# Altium project ECG-Circuit.PrjPcb
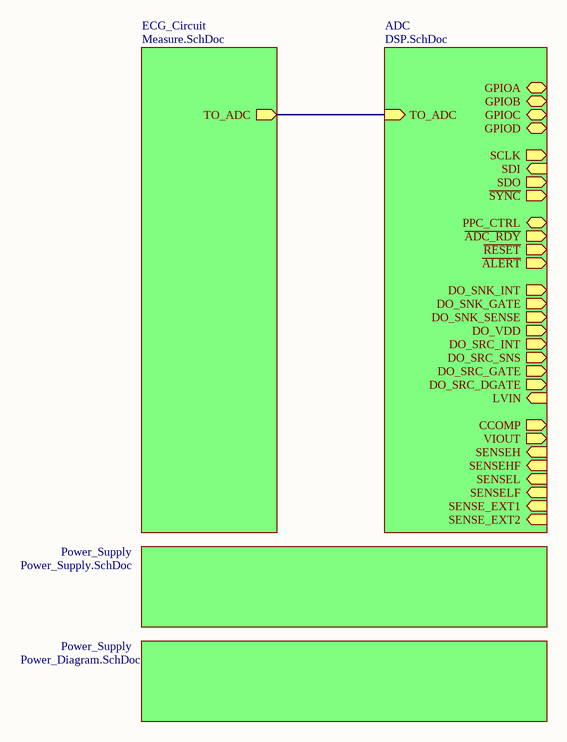
[diagram p0: System_Diagram.SchDoc]
5 sheets, 110 parts. Net scope: hierarchical (ports join the sheet entries above them; power ports are global).
Board file: PCB1.PcbDoc
Sheets:
  System_Diagram.SchDoc
    ECG_Circuit = Measure.SchDoc
    ADC = DSP.SchDoc
    Power_Supply = Power_Supply.SchDoc
    Power_Supply = Power_Diagram.SchDoc

## Sheet System_Diagram.SchDoc
size A4; SheetNumber: 1; SheetTotal: 5

### Sub-sheets
ADC = DSP.SchDoc: TO_ADC (in), GPIOA (bidir), GPIOB (bidir), GPIOC (bidir), GPIOD (bidir), SCLK (out), SDI (in), SDO (out), ~{SYNC} (out), PPC_CTRL (bidir), ~{ADC_RDY} (out), ~{RESET} (out), ~{ALERT} (out), DO_SNK_INT (out), DO_SNK_GATE (out), DO_SNK_SENSE (out), DO_VDD (out), DO_SRC_INT (out), DO_SRC_SNS (out), DO_SRC_GATE (out), DO_SRC_DGATE (out), LVIN (in), CCOMP (out), VIOUT (out), SENSEH (in), SENSEHF (in), SENSEL (in), SENSELF (in), SENSE_EXT1 (in), SENSE_EXT2 (in)
ECG_Circuit = Measure.SchDoc: TO_ADC (out)
Power_Supply = Power_Supply.SchDoc: no entries
Power_Supply = Power_Diagram.SchDoc: no entries

### Nets
TO_ADC: sheet ECG_Circuit/TO_ADC, sheet ADC/TO_ADC

## Sheet Measure.SchDoc
size A3; SheetNumber: 4; SheetTotal: 5
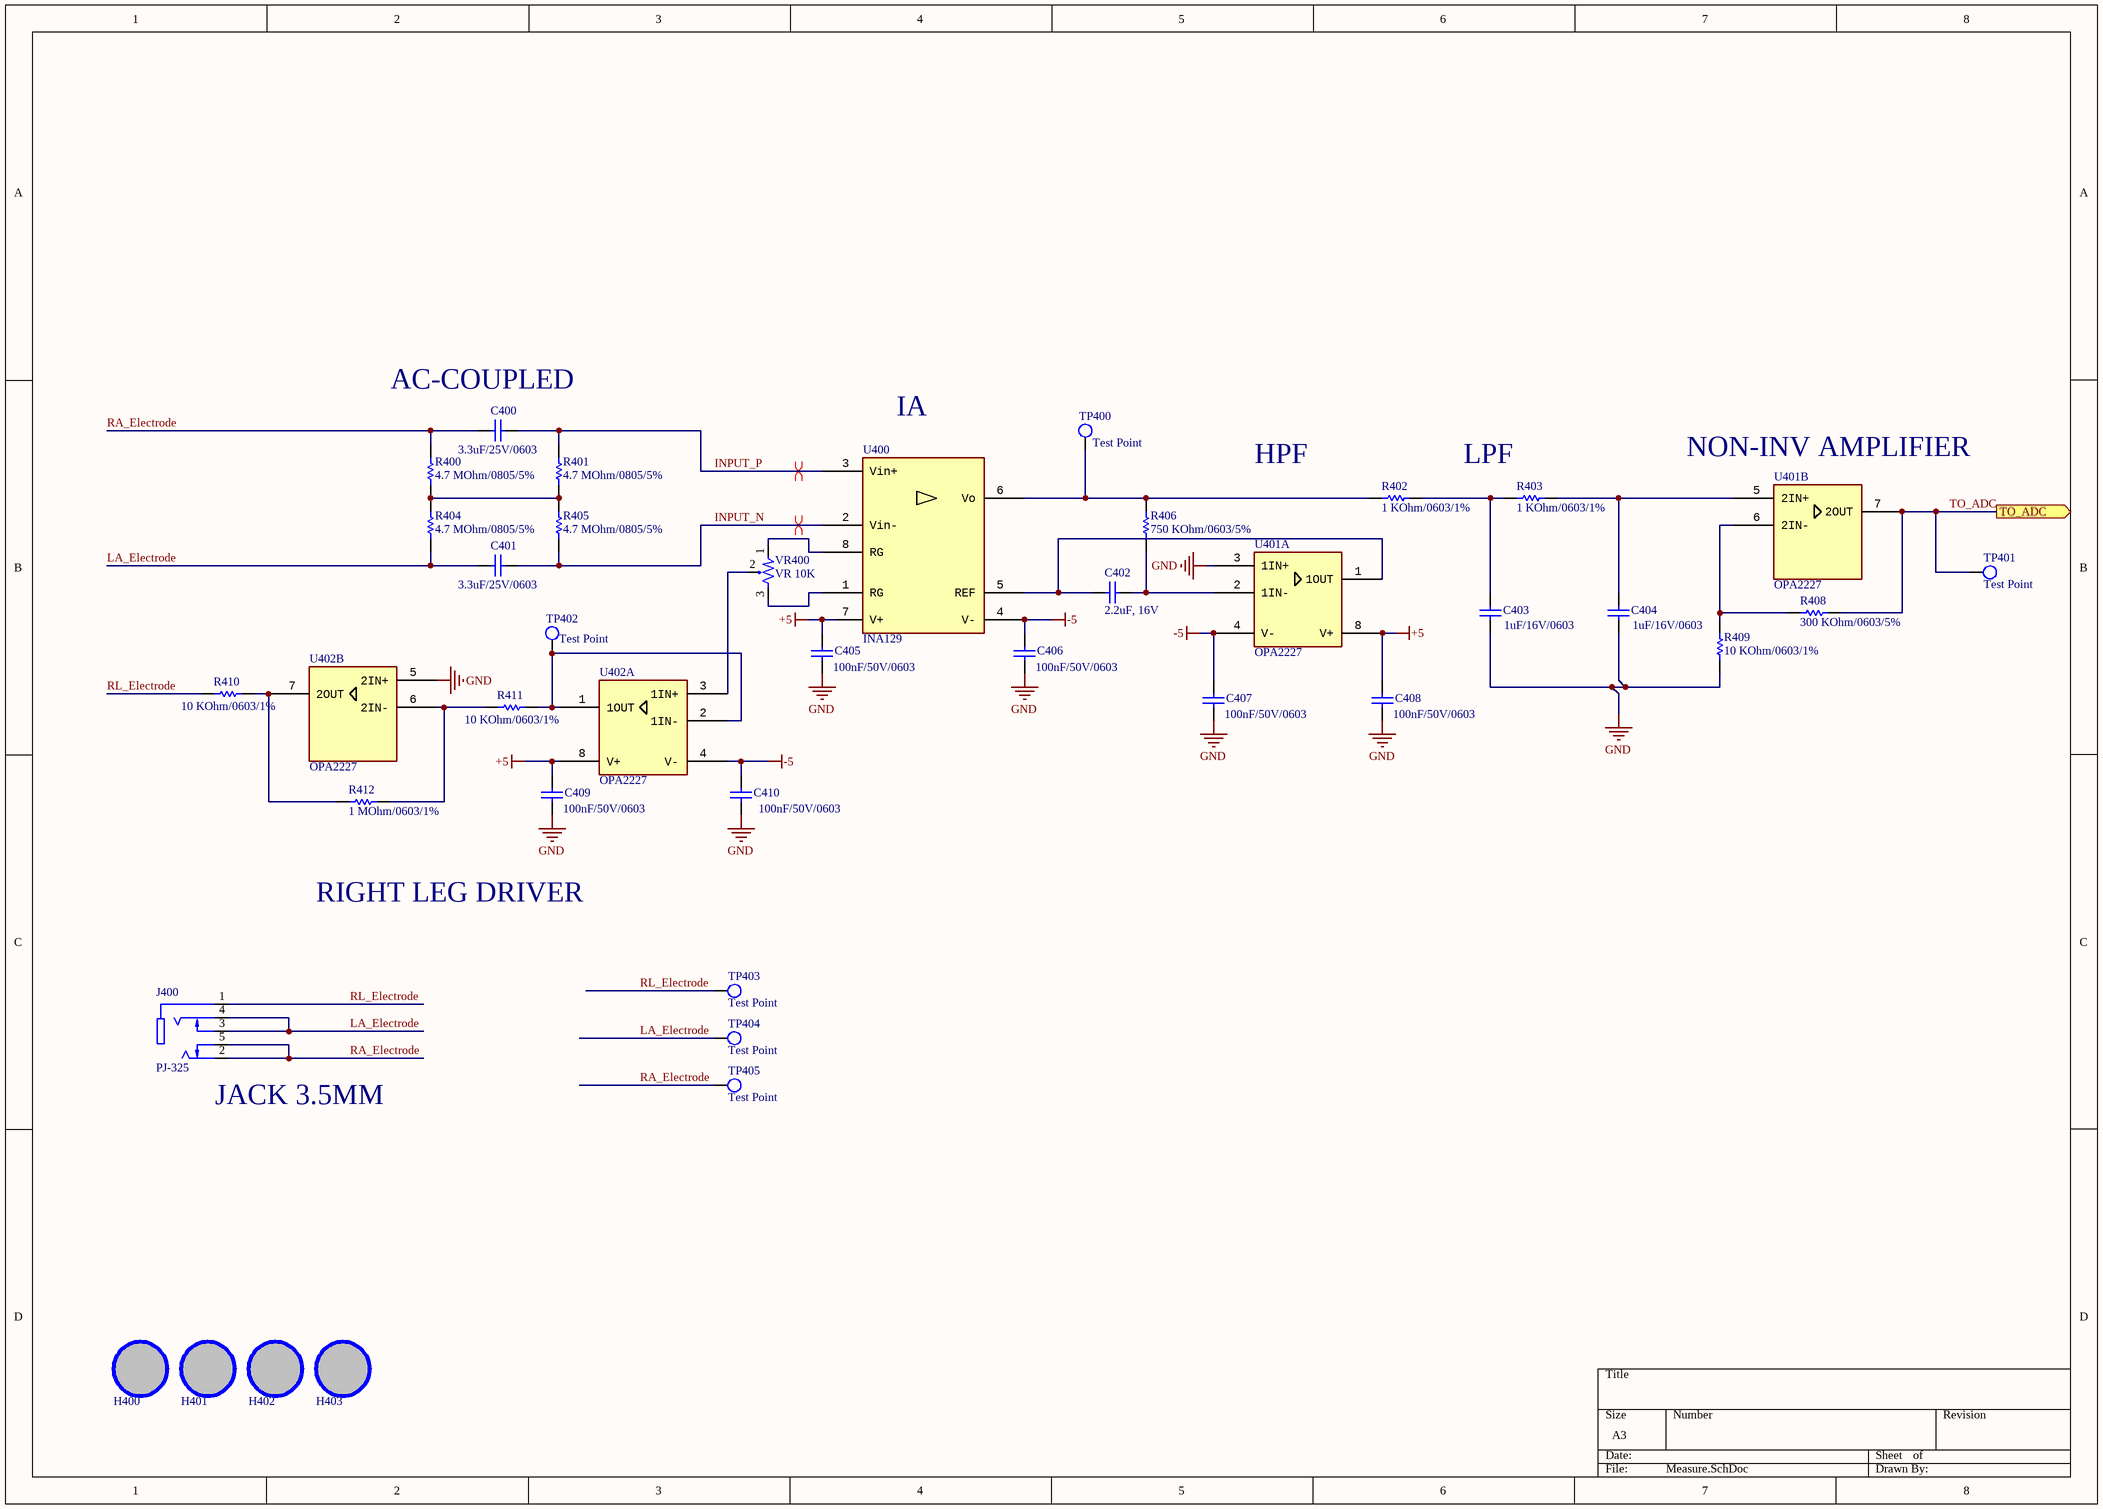
[diagram p1: Measure.SchDoc]

### Parts
C400  value 3.3uF/25V/0603  [WCAP-CSGP_0805_H=1.25mm]  (hidden comment: 3.3uF, 25V)
C401  value 3.3uF/25V/0603  [WCAP-CSGP_0805_H=1.25mm]  (hidden comment: 3.3uF, 25V)
C402  2.2uF, 16V  [WCAP-CSGP_0603_H=0.8mm_Reflow]
C403  value 1uF/16V/0603  [WCAP-CSGP_0603_H=0.8mm_Reflow]  (hidden comment: 1uF, 16V)
C404  value 1uF/16V/0603  [WCAP-CSGP_0603_H=0.8mm_Reflow]  (hidden comment: 1uF, 16V)
C405  value 100nF/50V/0603  [WCAP-CSGP_0603_H=0.8mm_Reflow]  (hidden comment: 100nF, 25V)
C406  value 100nF/50V/0603  [WCAP-CSGP_0603_H=0.8mm_Reflow]  (hidden comment: 100nF, 25V)
C407  value 100nF/50V/0603  [WCAP-CSGP_0603_H=0.8mm_Reflow]  (hidden comment: 100nF, 25V)
C408  value 100nF/50V/0603  [WCAP-CSGP_0603_H=0.8mm_Reflow]  (hidden comment: 100nF, 25V)
C409  value 100nF/50V/0603  [WCAP-CSGP_0603_H=0.8mm_Reflow]  (hidden comment: 100nF, 25V)
C410  value 100nF/50V/0603  [WCAP-CSGP_0603_H=0.8mm_Reflow]  (hidden comment: 100nF, 25V)
H400  Hole  [LO KHOAN 3MM]  (value not drawn)
H401  Hole  [LO KHOAN 3MM]  (value not drawn)
H402  Hole  [LO KHOAN 3MM]  (value not drawn)
H403  Hole  [LO KHOAN 3MM]  (value not drawn)
J400  value PJ-325  [3.5 mm, Strereo]  (hidden comment: PJ-324)
R400  value 4.7 MOhm/0805/5%  [R0805]  (hidden comment: Resistor 4.7 MOhm 0805 5%)
R401  value 4.7 MOhm/0805/5%  [R0805]  (hidden comment: Resistor 4.7 MOhm 0805 5%)
R402  value 1 KOhm/0603/1%  [R0603]  (hidden comment: Resistor 1 KOhm 0603 1%)
R403  value 1 KOhm/0603/1%  [R0603]  (hidden comment: Resistor 1 KOhm 0603 1%)
R404  value 4.7 MOhm/0805/5%  [R0805]  (hidden comment: Resistor 4.7 MOhm 0805 5%)
R405  value 4.7 MOhm/0805/5%  [R0805]  (hidden comment: Resistor 4.7 MOhm 0805 5%)
R406  value 750 KOhm/0603/5%  [R0603]  (hidden comment: Resistor 750 KOhm 0603 5%)
R408  value 300 KOhm/0603/5%  [R0603]  (hidden comment: Resistor 300 KOhm 0603 5%)
R409  value 10 KOhm/0603/1%  [R0603]  (hidden comment: Resistor 10 KOhm 0603 1%)
R410  value 10 KOhm/0603/1%  [R0603]  (hidden comment: Resistor 10 KOhm 0603 1%)
R411  value 10 KOhm/0603/1%  [R0603]  (hidden comment: Resistor 10 KOhm 0603 1%)
R412  value 1 MOhm/0603/1%  [R0603]  (hidden comment: Resistor 1 MOhm 0603 1%)
TP400  Test Point  [TP]
TP401  Test Point  [TP]
TP402  Test Point  [TP]
TP403  Test Point  [TP]
TP404  Test Point  [TP]
TP405  Test Point  [TP]
U400  INA129  [SOIC-8]
U401  OPA2227  [SOIC-8]  (parts A,B of 2)
U402  OPA2227  [SOIC-8]  (parts A,B of 2)
VR400  value VR 10K  [VARISTOR 2]  (hidden comment: 10K)

### Ports
TO_ADC (out)

### Nets
+5: C405.2 C408.1 C409.2 U400.7(V+) U401.8(V+) U402.8(V+)
-5: C406.1 C407.2 C410.1 U400.4(V-) U401.4(V-) U402.4(V-)
GND: C403.1 C404.1 C405.1 C406.2 C407.1 C408.2 C409.1 C410.2 R409.1 U401.3(1IN+) U402.5(2IN+)
INPUT_N: C401.2 R405.1 U400.2(Vin-)
INPUT_P: C400.2 R401.2 U400.3(Vin+)
LA_Electrode: C401.1 J400.3 J400.4 R404.1 TP404.TP1
RA_Electrode: C400.1 J400.2 J400.5 R400.2 TP405.TP1
RL_Electrode: J400.1 R410.1 TP403.TP1
TO_ADC: R408.2 TP401.TP1 U401.7(2OUT) ; port TO_ADC
NetC402_1: C402.1 R406.1 U401.2(1IN-)
NetC402_2: C402.2 U400.5(REF) U401.1(1OUT)
NetC403_2: C403.2 R402.2 R403.1
NetC404_2: C404.2 R403.2 U401.5(2IN+)
NetR400_1: R400.1 R401.1 R404.2 R405.2
NetR402_1: R402.1 R406.2 TP400.TP1 U400.6(Vo)
NetR408_1: R408.1 R409.2 U401.6(2IN-)
NetR410_2: R410.2 R412.1 U402.7(2OUT)
NetR411_1: R411.1 R412.2 U402.6(2IN-)
NetR411_2: R411.2 TP402.TP1 U402.1(1OUT) U402.2(1IN-)
NetU400_1: U400.1(RG) VR400.3
NetU400_8: U400.8(RG) VR400.1
NetU402_3: U402.3(1IN+) VR400.2

Not connected (* = marked no-connect by the designer): H400 1; H401 1; H402 1; H403 1

### Layout directives
differential pair: INPUT_N, INPUT_P

### Notes on the sheet
- (near C400) AC-COUPLED
- (near U400) IA
- HPF
- (near R403) LPF
- (near U401) NON-INV AMPLIFIER
- RIGHT LEG DRIVER
- (near J400) JACK 3.5MM

### Library data of the parts
C400 C401 = 885012107017: WCAP-CSGP Multilayer Ceramic Chip Capacitor, General Purpose, size 0805, X5R, 3.3uF, 25V; Manufacturer: Wurth Elektronik; Rated Voltage: 25VDC; Isolation Resistance: >=0.03GOhm; Capacitance Tolerance: +/-20%; Technical Reference: X5R0805335M025DFCT10000; ComponentLink1Description: Manufacturer; ComponentLink1URL: http://www.we-online.de; ComponentLink2Description: Datasheet; ComponentLink2URL: https://www.we-online.com/catalog/datasheet/885012107017.pdf; Operating Temperature: -55 to +85degC; Packaging: Tape and Reel; Manufacturer Part Number: 885012107017; Published Date: May 2020; Ceramic Type: X5R; Dissipation Factor: =<10%; Height: 1.25mm; Mounting Technology: SMT; Size: 0805
C402 = 885012106018: WCAP-CSGP Multilayer Ceramic Chip Capacitor, General Purpose, size 0603, X5R, 2.2uF, 16V; Manufacturer: Wurth Elektronik; Rated Voltage: 16VDC; Isolation Resistance: >=0.05GOhm; Capacitance Tolerance: +/-20%; Technical Reference: X5R0603225M016DFCT10000; ComponentLink1Description: Manufacturer; ComponentLink1URL: http://www.we-online.de; ComponentLink2Description: Datasheet; ComponentLink2URL: https://www.we-online.com/catalog/datasheet/885012106018.pdf; Operating Temperature: -55 to +85degC; Packaging: Tape and Reel; Manufacturer Part Number: 885012106018; Published Date: May 2020; Ceramic Type: X5R; Dissipation Factor: =<10%; Height: 0.8mm; Mounting Technology: SMT; Size: 0603; Capacitance: 2.2uF
C403 C404 = 885012106017: WCAP-CSGP Multilayer Ceramic Chip Capacitor, General Purpose, size 0603, X5R, 1uF, 16V; Manufacturer: Wurth Elektronik; Rated Voltage: 16VDC; Isolation Resistance: >=0.1GOhm; Capacitance Tolerance: +/-20%; Technical Reference: X5R0603105M016DFCT10000; ComponentLink1Description: Manufacturer; ComponentLink1URL: http://www.we-online.de; ComponentLink2Description: Datasheet; ComponentLink2URL: https://www.we-online.com/catalog/datasheet/885012106017.pdf; Operating Temperature: -55 to +85degC; Packaging: Tape and Reel; Manufacturer Part Number: 885012106017; Published Date: May 2020; Ceramic Type: X5R; Dissipation Factor: =<10%; Height: 0.8mm; Mounting Technology: SMT; Size: 0603
C405-C410 = 885012206071: WCAP-CSGP Multilayer Ceramic Chip Capacitor, General Purpose, size 0603, X7R, 100nF, 25V; Manufacturer: Wurth Elektronik; Rated Voltage: 25VDC; Isolation Resistance: >=5GOhm; Capacitance Tolerance: +/-10%; Technical Reference: X7R0603104K025DFCT10000; ComponentLink1Description: Manufacturer; ComponentLink1URL: http://www.we-online.de; ComponentLink2Description: Datasheet; ComponentLink2URL: https://www.we-online.com/catalog/datasheet/885012206071.pdf; Operating Temperature: -55 to +125degC; Packaging: Tape and Reel; Manufacturer Part Number: 885012206071; Published Date: May 2020; Ceramic Type: X7R; Dissipation Factor: =<3.5%; Height: 0.8mm; Mounting Technology: SMT; Size: 0603
H400-H403 = Hole: Hole 3mm
J400 = PJ-324: Jack 3.5 3-Pole 5-Pin; ComponentLink1Description: Buy; ComponentLink1URL: https://www.thegioiic.com/pj-324-cong-audio-3-5mm-3-cuc-5-chan-han-pcb
R400 R401 R404 R405 = Resistor 4.7 MOhm 0805 5%: Code 475, 1/8W; ComponentLink1Description: Buy; ComponentLink1URL: https://www.thegioiic.com/dien-tro-4-7-mohm-0805-5-
R402 R403 = Resistor 1 KOhm 0603 1%: Code 102, 1/10W; ComponentLink1Description: Buy; ComponentLink1URL: https://www.thegioiic.com/dien-tro-1-kohm-0603-1
R406 = Resistor 750 KOhm 0603 5%: Code 754, 1/10W
R408 = Resistor 300 KOhm 0603 5%: Code 304, 1/10W
R409-R411 = Resistor 10 KOhm 0603 1%: Code 103, 1/10W; ComponentLink1Description: Buy; ComponentLink1URL: https://www.thegioiic.com/dien-tro-10-kohm-0603-1-
R412 = Resistor 1 MOhm 0603 1%: Code 105, 1/10W; ComponentLink1Description: Buy; ComponentLink1URL: https://www.thegioiic.com/dien-tro-1-mohm-0603-1-
U400 = INA129: Precision, Low Power Instrumentation Amplifiers; ComponentLink1Description: Buy; ComponentLink1URL: *; ComponentLink2Description: Datasheet; ComponentLink2URL: https://www.ti.com/lit/ds/symlink/ina129-ep.pdf?ts=1697381225295&ref_url=https%253A%252F%252Fwww.google.com%252F; Value: INA129
U401 U402 = OPA2227: High-Precision, Low-Noise Operational Amplifiers; ComponentLink1Description: Datasheet; ComponentLink1URL: https://www.ti.com/lit/ds/symlink/opa2227.pdf?ts=1697381749451&ref_url=https%253A%252F%252Fwww.ti.com%252Fproduct%252FOPA2227; Value: OPA2227
VR400 = Var Resistor

## Sheet DSP.SchDoc
size A3; SheetNumber: 5; SheetTotal: 5
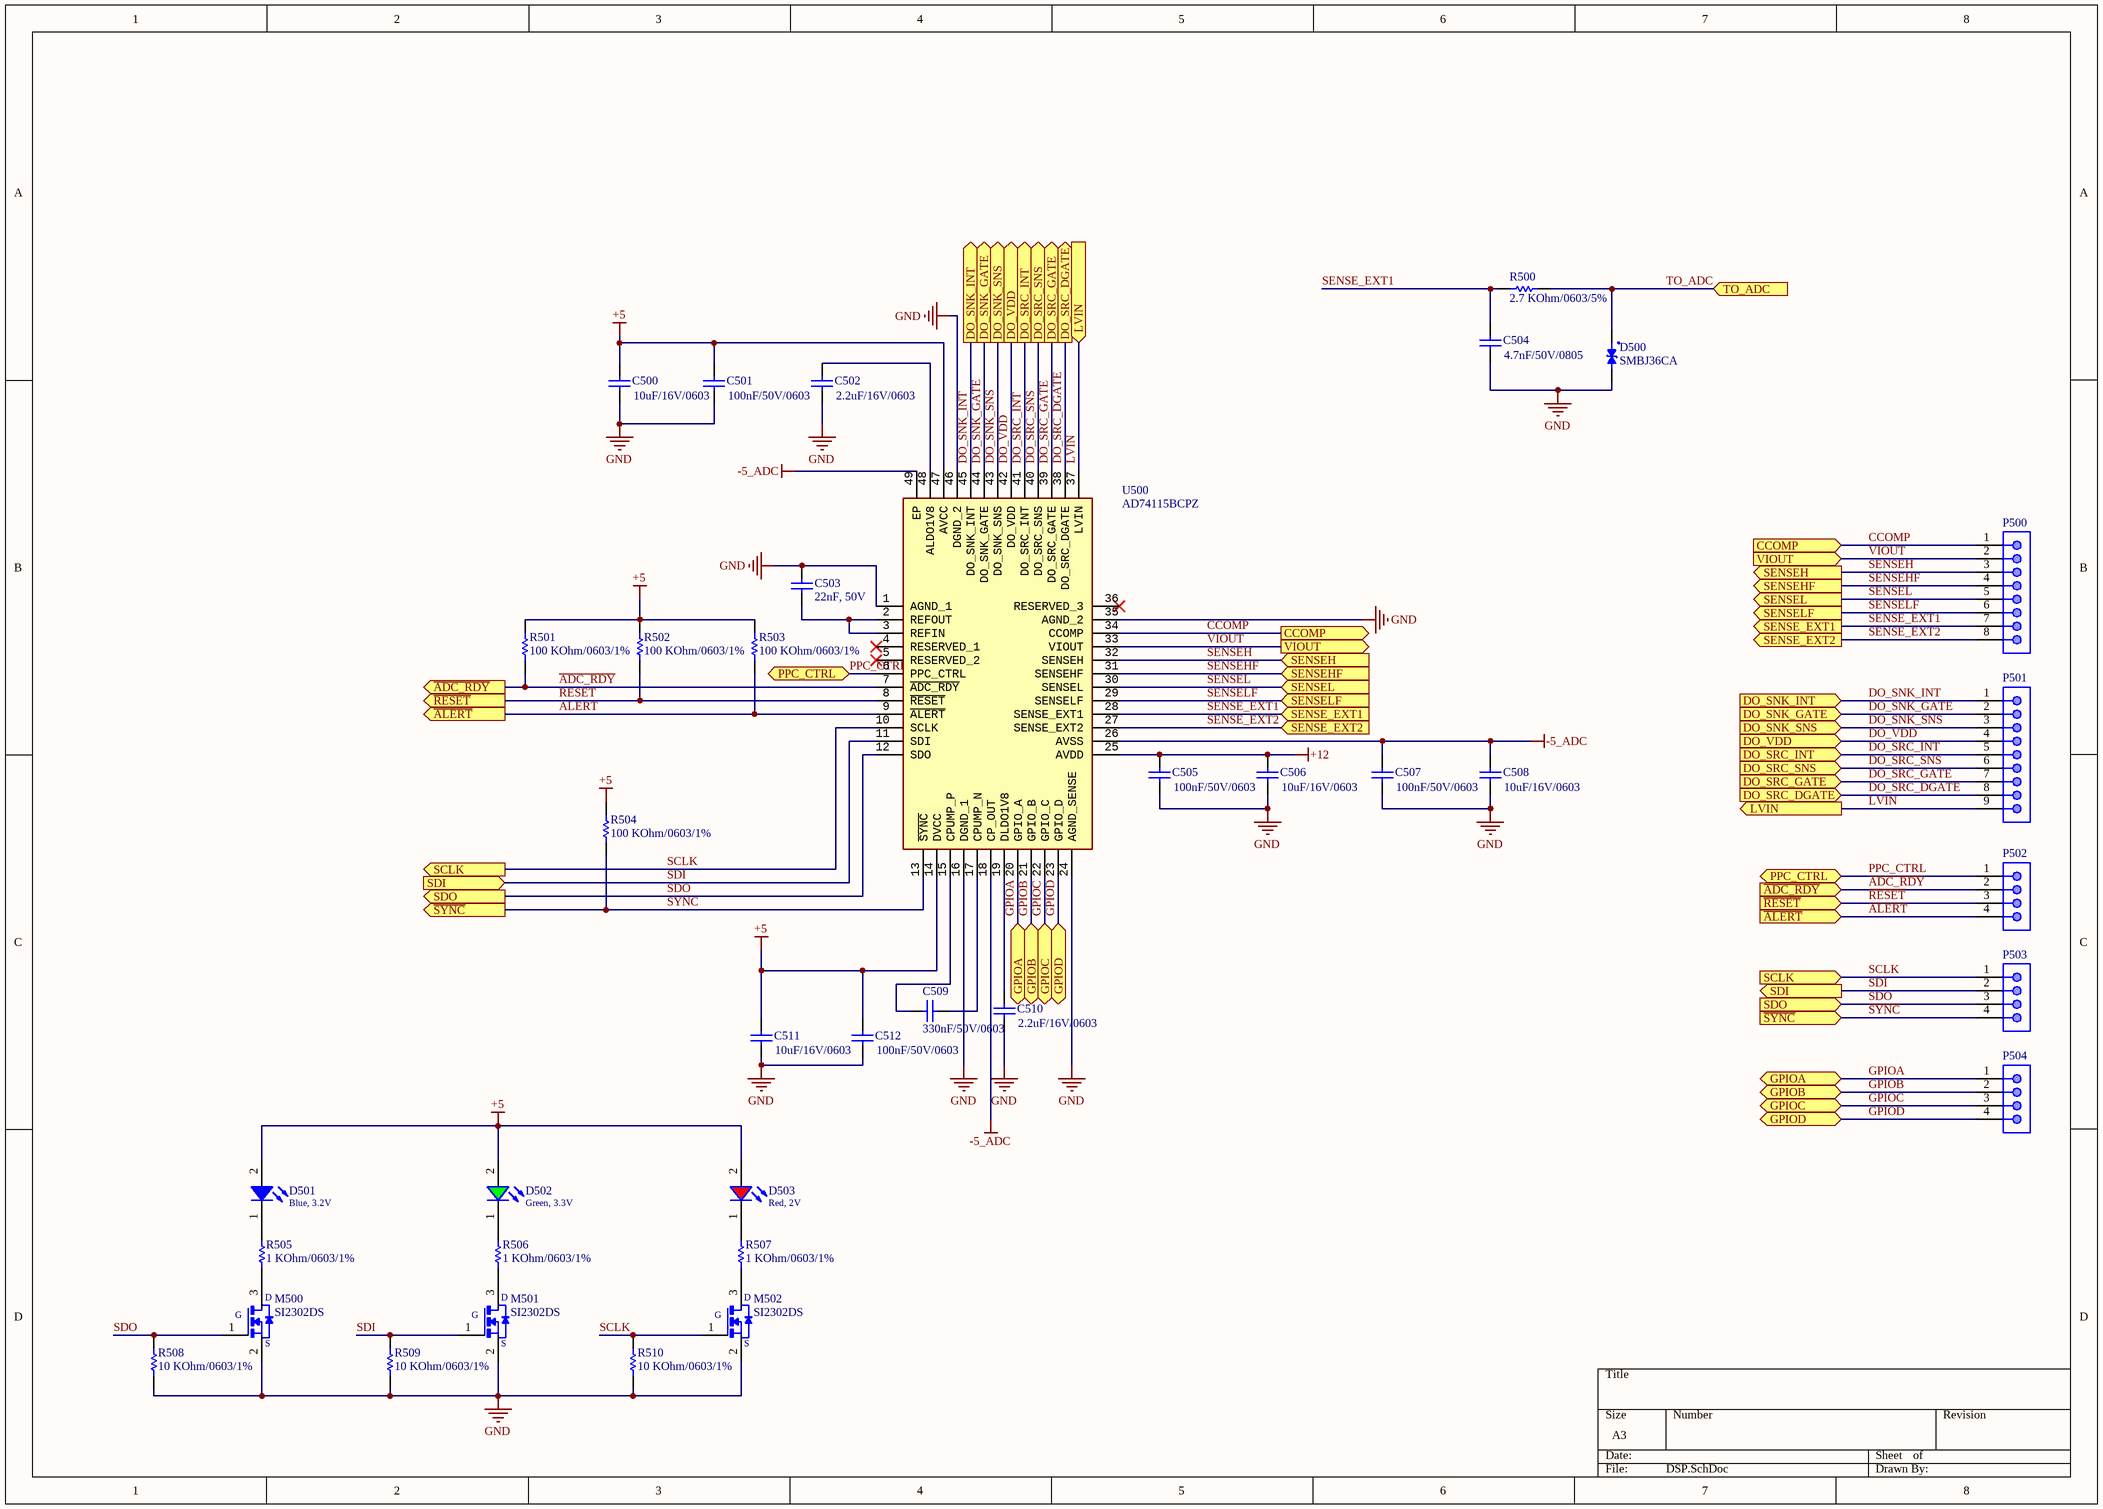
[diagram p2: DSP.SchDoc]

### Parts
C500  value 10uF/16V/0603  [WCAP-CSGP_0603_H=0.8mm_Reflow]  (hidden comment: 10uF, 6.3V)
C501  Capacitance: 100nF/50V/0603  [WCAP-CSGP_0603_H=0.8mm_Reflow]  (hidden comment: 100nF, 50V)
C502  value 2.2uF/16V/0603  [WCAP-CSGP_0603_H=0.8mm_Reflow]  (hidden comment: 2.2uF, 16V)
C503  22nF, 50V  [WCAP-CSGP_0603_H=0.8mm_Reflow]
C504  Capacitance: 4.7nF/50V/0805  [WCAP-CSGP_0805_H=1.25mm]  (hidden comment: 4.7nF, 100V)
C505  Capacitance: 100nF/50V/0603  [WCAP-CSGP_0603_H=0.8mm_Reflow]  (hidden comment: 100nF, 50V)
C506  value 10uF/16V/0603  [WCAP-CSGP_0603_H=0.8mm_Reflow]  (hidden comment: 10uF, 6.3V)
C507  Capacitance: 100nF/50V/0603  [WCAP-CSGP_0603_H=0.8mm_Reflow]  (hidden comment: 100nF, 50V)
C508  value 10uF/16V/0603  [WCAP-CSGP_0603_H=0.8mm_Reflow]  (hidden comment: 10uF, 6.3V)
C509  value 330nF/50V/0603  [WCAP-CSGP_0603_H=0.8mm_Reflow]  (hidden comment: 330nF, 50V)
C510  value 2.2uF/16V/0603  [WCAP-CSGP_0603_H=0.8mm_Reflow]  (hidden comment: 2.2uF, 16V)
C511  value 10uF/16V/0603  [WCAP-CSGP_0603_H=0.8mm_Reflow]  (hidden comment: 10uF, 6.3V)
C512  Capacitance: 100nF/50V/0603  [WCAP-CSGP_0603_H=0.8mm_Reflow]  (hidden comment: 100nF, 50V)
D500  SMBJ36CA  [DIOM4336X265N]
D501  Blue, 3.2V  [WL-SMCW_0603 dome]
D502  Green, 3.3V  [WL-SMCW_0603 dome]
D503  Red, 2V  [WL-SMCW_0603 dome]
M500  value SI2302DS  [SOT23]  (hidden comment: SI2302)
M501  value SI2302DS  [SOT23]  (hidden comment: SI2302)
M502  value SI2302DS  [SOT23]  (hidden comment: SI2302)
P500  61300811121  [61300811121]  (value not drawn)
P501  61300911121  [61300911121]  (value not drawn)
P502  61300411121  [61300411121]  (value not drawn)
P503  61300411121  [61300411121]  (value not drawn)
P504  61300411121  [61300411121]  (value not drawn)
R500  value 2.7 KOhm/0603/5%  [R0603]  (hidden comment: Resistor 2.7 KOhm 0603 5%)
R501  value 100 KOhm/0603/1%  [R0603]  (hidden comment: Resistor 100 KOhm 0603 1%)
R502  value 100 KOhm/0603/1%  [R0603]  (hidden comment: Resistor 100 KOhm 0603 1%)
R503  value 100 KOhm/0603/1%  [R0603]  (hidden comment: Resistor 100 KOhm 0603 1%)
R504  value 100 KOhm/0603/1%  [R0603]  (hidden comment: Resistor 100 KOhm 0603 1%)
R505  value 1 KOhm/0603/1%  [R0603]  (hidden comment: Resistor 1 KOhm 0603 1%)
R506  value 1 KOhm/0603/1%  [R0603]  (hidden comment: Resistor 1 KOhm 0603 1%)
R507  value 1 KOhm/0603/1%  [R0603]  (hidden comment: Resistor 1 KOhm 0603 1%)
R508  value 10 KOhm/0603/1%  [R0603]  (hidden comment: Resistor 10 KOhm 0603 1%)
R509  value 10 KOhm/0603/1%  [R0603]  (hidden comment: Resistor 10 KOhm 0603 1%)
R510  value 10 KOhm/0603/1%  [R0603]  (hidden comment: Resistor 10 KOhm 0603 1%)
U500  AD74115BCPZ  [QFN50P700X700X80-49N-D]

### Ports
CCOMP (in), CCOMP (out), DO_SNK_GATE (in), DO_SNK_GATE (out), DO_SNK_INT (in), DO_SNK_INT (out), DO_SNK_SNS (in), DO_SNK_SNS (out), DO_SRC_DGATE (in), DO_SRC_DGATE (out), DO_SRC_GATE (in), DO_SRC_GATE (out), DO_SRC_INT (in), DO_SRC_INT (out), DO_SRC_SNS (in), DO_SRC_SNS (out), DO_VDD (in), DO_VDD (out), GPIOA (bidir), GPIOB (bidir), GPIOC (bidir), GPIOD (bidir), LVIN (in), LVIN (out), PPC_CTRL (bidir), SCLK (in), SCLK (out), SDI (in), SDI (out), SDO (in), SDO (out), SENSE_EXT1 (in), SENSE_EXT1 (out), SENSE_EXT2 (in), SENSE_EXT2 (out), SENSEH (in), SENSEH (out), SENSEHF (in), SENSEHF (out), SENSEL (in), SENSEL (out), SENSELF (in), SENSELF (out), TO_ADC (in), VIOUT (in), VIOUT (out), ~{ADC_RDY} (in), ~{ADC_RDY} (out), ~{ALERT} (in), ~{ALERT} (out), ~{RESET} (in), ~{RESET} (out), ~{SYNC} (in), ~{SYNC} (out)

### Nets
+5: C500.2 C501.2 C511.2 C512.2 D501.2(A) D502.2(A) D503.2(A) R501.2 R502.2 R503.2 R504.1 U500.14(DVCC) U500.47(AVCC)
+12: C505.2 C506.2 U500.25(AVDD)
-5_ADC: C507.2 C508.2 U500.18(CP_OUT) U500.26(AVSS) U500.49(EP)
GND: C500.1 C501.1 C502.1 C503.2 C504.1 C505.1 C506.1 C507.1 C508.1 C510.1 C511.1 C512.1 D500.2 M500.2(S) M501.2(S) M502.2(S) R508.1 R509.1 R510.1 U500.1(AGND_1) U500.16(DGND_1) U500.24(AGND_SENSE) U500.35(AGND_2) U500.46(DGND_2)
~{ADC_RDY}: P502.2 R501.1 U500.7(~{ADC_RDY}) ; port ~{ADC_RDY}
~{ALERT}: P502.4 R503.1 U500.9(~{ALERT}) ; port ~{ALERT}
CCOMP: P500.1 U500.34(CCOMP) ; port CCOMP
DO_SNK_GATE: P501.2 U500.44(DO_SNK_GATE) ; port DO_SNK_GATE
DO_SNK_INT: P501.1 U500.45(DO_SNK_INT) ; port DO_SNK_INT
DO_SNK_SNS: P501.3 U500.43(DO_SNK_SNS) ; port DO_SNK_SNS
DO_SRC_DGATE: P501.8 U500.38(DO_SRC_DGATE) ; port DO_SRC_DGATE
DO_SRC_GATE: P501.7 U500.39(DO_SRC_GATE) ; port DO_SRC_GATE
DO_SRC_INT: P501.5 U500.41(DO_SRC_INT) ; port DO_SRC_INT
DO_SRC_SNS: P501.6 U500.40(DO_SRC_SNS) ; port DO_SRC_SNS
DO_VDD: P501.4 U500.42(DO_VDD) ; port DO_VDD
GPIOA: P504.1 U500.20(GPIO_A) ; port GPIOA
GPIOB: P504.2 U500.21(GPIO_B) ; port GPIOB
GPIOC: P504.3 U500.22(GPIO_C) ; port GPIOC
GPIOD: P504.4 U500.23(GPIO_D) ; port GPIOD
LVIN: P501.9 U500.37(LVIN) ; port LVIN
PPC_CTRL: P502.1 U500.6(PPC_CTRL) ; port PPC_CTRL
~{RESET}: P502.3 R502.1 U500.8(~{RESET}) ; port ~{RESET}
~{SYNC}: P503.4 R504.2 U500.13(~{SYNC}) ; port ~{SYNC}
SCLK: M502.1(G) P503.1 R510.2 U500.10(SCLK) ; port SCLK
SDI: M501.1(G) P503.2 R509.2 U500.11(SDI) ; port SDI
SDO: M500.1(G) P503.3 R508.2 U500.12(SDO) ; port SDO
SENSE_EXT1: C504.2 P500.7 R500.1 U500.28(SENSE_EXT1) ; port SENSE_EXT1
SENSE_EXT2: P500.8 U500.27(SENSE_EXT2) ; port SENSE_EXT2
SENSEH: P500.3 U500.32(SENSEH) ; port SENSEH
SENSEHF: P500.4 U500.31(SENSEHF) ; port SENSEHF
SENSEL: P500.5 U500.30(SENSEL) ; port SENSEL
SENSELF: P500.6 U500.29(SENSELF) ; port SENSELF
TO_ADC: D500.1 R500.2 ; port TO_ADC
VIOUT: P500.2 U500.33(VIOUT) ; port VIOUT
NetC502_2: C502.2 U500.48(ALDO1V8)
NetC503_1: C503.1 U500.2(REFOUT) U500.3(REFIN)
NetC509_1: C509.1 U500.17(CPUMP_N)
NetC509_2: C509.2 U500.15(CPUMP_P)
NetC510_2: C510.2 U500.19(DLDO1V8)
NetD501_1: D501.1(K) R505.2
NetD502_1: D502.1(K) R506.2
NetD503_1: D503.1(K) R507.2
NetM500_3: M500.3(D) R505.1
NetM501_3: M501.3(D) R506.1
NetM502_3: M502.3(D) R507.1

Not connected (* = marked no-connect by the designer): U500 4(RESERVED_1)* 5(RESERVED_2)* 36(RESERVED_3)*

### Library data of the parts
C500 C506 C508 C511 = 885012106006: WCAP-CSGP Multilayer Ceramic Chip Capacitor, General Purpose, size 0603, X5R, 10uF, 6.3V; Manufacturer: Wurth Elektronik; Rated Voltage: 6.3VDC; Isolation Resistance: >=0.01GOhm; Capacitance Tolerance: +/-20%; Technical Reference: X5R0603106M6R3DFCT10000; ComponentLink1Description: Manufacturer; ComponentLink1URL: http://www.we-online.de; ComponentLink2Description: Datasheet; ComponentLink2URL: https://www.we-online.com/catalog/datasheet/885012106006.pdf; Operating Temperature: -55 to +85degC; Packaging: Tape and Reel; Manufacturer Part Number: 885012106006; Published Date: May 2020; Ceramic Type: X5R; Dissipation Factor: =<10%; Height: 0.8mm; Mounting Technology: SMT; Size: 0603
C501 C505 C507 C512 = 885012206095: WCAP-CSGP Multilayer Ceramic Chip Capacitor, General Purpose, size 0603, X7R, 100nF, 50V; Manufacturer: Wurth Elektronik; Rated Voltage: 50VDC; Isolation Resistance: >=5GOhm; Capacitance Tolerance: +/-10%; Technical Reference: X7R0603104K050DFCT10000; ComponentLink1Description: Manufacturer; ComponentLink1URL: http://www.we-online.de; ComponentLink2Description: Datasheet; ComponentLink2URL: https://www.we-online.com/catalog/datasheet/885012206095.pdf; Operating Temperature: -55 to +125degC; Packaging: Tape and Reel; Manufacturer Part Number: 885012206095; Published Date: May 2020; Ceramic Type: X7R; Dissipation Factor: =<3%; Height: 0.8mm; Mounting Technology: SMT; Size: 0603
C502 C510 = 885012106018: as C402 on sheet Measure; ComponentLink1Description: Manufacturer; ComponentLink1URL: http://www.we-online.de; ComponentLink2Description: Datasheet; ComponentLink2URL: https://www.we-online.com/catalog/datasheet/885012106018.pdf; Operating Temperature: -55 to +85degC; Packaging: Tape and Reel; Manufacturer Part Number: 885012106018; Published Date: May 2020; Ceramic Type: X5R; Dissipation Factor: =<10%; Height: 0.8mm; Mounting Technology: SMT; Size: 0603
C503 = 885012206091: WCAP-CSGP Multilayer Ceramic Chip Capacitor, General Purpose, size 0603, X7R, 22nF, 50V; Manufacturer: Wurth Elektronik; Rated Voltage: 50VDC; Isolation Resistance: >=10GOhm; Capacitance Tolerance: +/-10%; Technical Reference: X7R0603223K050DFCT10000; ComponentLink1Description: Manufacturer; ComponentLink1URL: http://www.we-online.de; ComponentLink2Description: Datasheet; ComponentLink2URL: https://www.we-online.com/catalog/datasheet/885012206091.pdf; Operating Temperature: -55 to +125degC; Packaging: Tape and Reel; Manufacturer Part Number: 885012206091; Published Date: May 2020; Ceramic Type: X7R; Dissipation Factor: =<2.5%; Height: 0.8mm; Mounting Technology: SMT; Size: 0603; Capacitance: 22nF
C504 = 885012007092: WCAP-CSGP Multilayer Ceramic Chip Capacitor, General Purpose, size 0805, NP0, 4.7nF, 100V; Manufacturer: Wurth Elektronik; Rated Voltage: 100VDC; Isolation Resistance: >=10GOhm; Capacitance Tolerance: +/-5%; Dissipation Factor: Q>=1000; Technical Reference: NP00805472J100DFCT10000; ComponentLink1Description: Manufacturer; ComponentLink1URL: http://www.we-online.de; ComponentLink2Description: Datasheet; ComponentLink2URL: https://www.we-online.com/catalog/datasheet/885012007092.pdf; Operating Temperature: -55 to +125degC; Packaging: Tape and Reel; Manufacturer Part Number: 885012007092; Published Date: May 2020; Ceramic Type: NP0; Height: 1.25mm; Mounting Technology: SMT; Size: 0805
C509 = 885012206121: WCAP-CSGP Multilayer Ceramic Chip Capacitor, General Purpose, size 0603, X7R, 330nF, 50V; Manufacturer: Wurth Elektronik; Rated Voltage: 50VDC; Isolation Resistance: >=1.5GOhm; Capacitance Tolerance: +/-10%; Technical Reference: X7R0603334K050DFCT10000; ComponentLink1Description: Manufacturer; ComponentLink1URL: http://www.we-online.de; ComponentLink2Description: Datasheet; ComponentLink2URL: https://www.we-online.com/catalog/datasheet/885012206121.pdf; Operating Temperature: -55 to +125degC; Packaging: Tape and Reel; Manufacturer Part Number: 885012206121; Published Date: May 2020; Ceramic Type: X7R; Dissipation Factor: =<10%; Height: 0.8mm; Mounting Technology: SMT; Size: 0603
D500 = SMBJ36CA: 600W, 42.1V, 5%, Bidirectional, TVS; MF: Taiwan Semiconductor; SnapEDA_Link: https://www.snapeda.com/parts/SMBJ36CA/Taiwan+Semiconductor/view-part/?ref=snap; Package: SMB Taiwan Semiconductor; MP: SMBJ36CA; Check_prices: https://www.snapeda.com/parts/SMBJ36CA/Taiwan+Semiconductor/view-part/?ref=eda; Purchase-URL: https://pricing.snapeda.com/search/part/SMBJ36CA/?ref=eda; Price: None; Availability: In Stock; ComponentLink1Description: Buy; ComponentLink1URL: https://www.thegioiic.com/smbj36ca; Value: SMBJ36CA
D501 = 150060BS84000: WL-SMCW SMT Mono-color Chip LED Waterclear, size 0603 dome, Blue, 3.2V, 40deg; Chip Technology: InGaN; Dominant Wavelength typ.: 470nm; Luminous Intensity typ.: 560mcd; Peak Wavelength typ.: 465nm; Viewing Angle: 40deg; ComponentLink1Description: Manufacturer; ComponentLink1URL: http://www.we-online.de; ComponentLink2URL: https://www.we-online.com/catalog/datasheet/150060BS84000.pdf; ComponentLink2Description: Datasheet; Forward Voltage typ.: 3.2V; Emitting Color: Blue; Mounting Technology: SMT; Operating Temperature: -40 to +85degC; Published Date: December 2019; Part Number: 150060BS84000; Packaging: Tape and Reel; Size: 0603 dome; Publisher: Wurth Elektronik
D502 = 150060GS84000: WL-SMCW SMT Mono-color Chip LED Waterclear, size 0603 dome, Green, 3.3V, 40deg; Chip Technology: InGaN; Dominant Wavelength typ.: 525nm; Luminous Intensity typ.: 3000mcd; Peak Wavelength typ.: 520nm; Viewing Angle: 40deg; ComponentLink1Description: Manufacturer; ComponentLink1URL: http://www.we-online.de; ComponentLink2URL: https://www.we-online.com/catalog/datasheet/150060GS84000.pdf; ComponentLink2Description: Datasheet; Forward Voltage typ.: 3.3V; Emitting Color: Green; Mounting Technology: SMT; Operating Temperature: -40 to +85degC; Published Date: December 2019; Part Number: 150060GS84000; Packaging: Tape and Reel; Size: 0603 dome; Publisher: Wurth Elektronik
D503 = 150060RS86000: WL-SMCW SMT Mono-color Chip LED Waterclear, size 0603 dome, Red, 2V, 60deg; Chip Technology: AlInGaP; Dominant Wavelength typ.: 624nm; Luminous Intensity typ.: 800mcd; Peak Wavelength typ.: 632nm; Viewing Angle: 60deg; ComponentLink1Description: Manufacturer; ComponentLink1URL: http://www.we-online.de; ComponentLink2URL: https://www.we-online.com/catalog/datasheet/150060RS86000.pdf; ComponentLink2Description: Datasheet; Forward Voltage typ.: 2V; Emitting Color: Red; Mounting Technology: SMT; Operating Temperature: -40 to +85degC; Published Date: December 2019; Part Number: 150060RS86000; Packaging: Tape and Reel; Size: 0603 dome; Publisher: Wurth Elektronik
M500-M502 = SI2302: N-Channel 20 V 2.6A (Ta) 710mW (Ta) Surface Mount SOT-23-3 (TO-236); MF: Vishay Siliconix; Price: None; Availability: In Stock; Package: SOT-23-3 Vishay Siliconix; MP: SI2302; SnapEDA_Link: https://www.snapeda.com/parts/SI2302/Vishay+Siliconix/view-part/?ref=snap; Purchase-URL: https://pricing.snapeda.com/search/part/SI2302/?ref=eda; Check_prices: https://www.snapeda.com/parts/SI2302/Vishay+Siliconix/view-part/?ref=eda; ComponentLink1Description: Buy; ComponentLink1URL: https://www.thegioiic.com/si2302ds-mosfet-kenh-n-20v-2-5a-sot23
P500 = 61300811121: WR-PHD Pin Header, THT, pitch 2.54mm, Single Row, Vertical, 8p; Manufacturer: Wurth Elektronik; Pin Number: 8; Rated Current: 3A; Working Voltage: 250VAC; Withstanding Voltage: 500VAC; Contact Resistance: 20mOhm; ComponentLink1Description: Manufacturer; ComponentLink1URL: http://www.we-online.de; ComponentLink2Description: Datasheet; ComponentLink2URL: https://www.we-online.com/catalog/datasheet/61300811121.pdf; Manufacturer Part Number: 61300811121; Published Date: May 2020; Pitch: 2.54mm; Operating Temperature: -40 to +105degC; Mounting Technology: THT; Packaging: Bag; Gender: Pin Header; Row Number: Single; Orientation: Vertical
P501 = 61300911121: WR-PHD Pin Header, THT, pitch 2.54mm, Single Row, Vertical, 9p; Manufacturer: Wurth Elektronik; Pin Number: 9; Rated Current: 3A; Working Voltage: 250VAC; Withstanding Voltage: 500VAC; Contact Resistance: 20mOhm; ComponentLink1Description: Manufacturer; ComponentLink1URL: http://www.we-online.de; ComponentLink2Description: Datasheet; ComponentLink2URL: https://www.we-online.com/catalog/datasheet/61300911121.pdf; Manufacturer Part Number: 61300911121; Published Date: May 2020; Pitch: 2.54mm; Operating Temperature: -40 to +105degC; Mounting Technology: THT; Packaging: Bag; Gender: Pin Header; Row Number: Single; Orientation: Vertical
P502-P504 = 61300411121: WR-PHD Pin Header, THT, pitch 2.54mm, Single Row, Vertical, 4p; Manufacturer: Wurth Elektronik; Pin Number: 4; Rated Current: 3A; Working Voltage: 250VAC; Withstanding Voltage: 500VAC; Contact Resistance: 20mOhm; ComponentLink1Description: Manufacturer; ComponentLink1URL: http://www.we-online.de; ComponentLink2Description: Datasheet; ComponentLink2URL: https://www.we-online.com/catalog/datasheet/61300411121.pdf; Manufacturer Part Number: 61300411121; Published Date: May 2020; Pitch: 2.54mm; Operating Temperature: -40 to +105degC; Mounting Technology: THT; Packaging: Bag; Gender: Pin Header; Row Number: Single; Orientation: Vertical
R500 = Resistor 2.7 KOhm 0603 5%: Code 272, 1/10W; ComponentLink1Description: Buy; ComponentLink1URL: https://www.thegioiic.com/dien-tro-2-7-kohm-0603-5-
R501-R504 = Resistor 100 KOhm 0603 1%: Code 104, 1/10W; ComponentLink1Description: Buy; ComponentLink1URL: https://www.thegioiic.com/dien-tro-100-kohm-0603-1-
R505-R507 = Resistor 1 KOhm 0603 1%: Code 102, 1/10W; ComponentLink1Description: Buy; ComponentLink1URL: https://www.thegioiic.com/dien-tro-1-kohm-0603-1
R508-R510 = Resistor 10 KOhm 0603 1%: Code 103, 1/10W; ComponentLink1Description: Buy; ComponentLink1URL: https://www.thegioiic.com/dien-tro-10-kohm-0603-1-
U500 = AD74115BCPZ: Single-Channel, Software Configurable Input and Output; Manufacturer_Name: Analog Devices; Geometry.Height: 0.8mm; Manufacturer_Part_Number: AD74115BCPZ; Mouser Part Number: 584-AD74115BCPZ; Mouser Price/Stock: https://www.mouser.co.uk/ProductDetail/Analog-Devices/AD74115BCPZ?qs=Jm2GQyTW%2FbiQ8agDBTeo0A%3D%3D; Arrow Part Number: *; Arrow Price/Stock: *; Datasheet Link: https://www.analog.com/AD74115/datasheet; Value: AD74115BCPZ

## Sheet Power_Supply.SchDoc
size A4; SheetNumber: 3; SheetTotal: 5
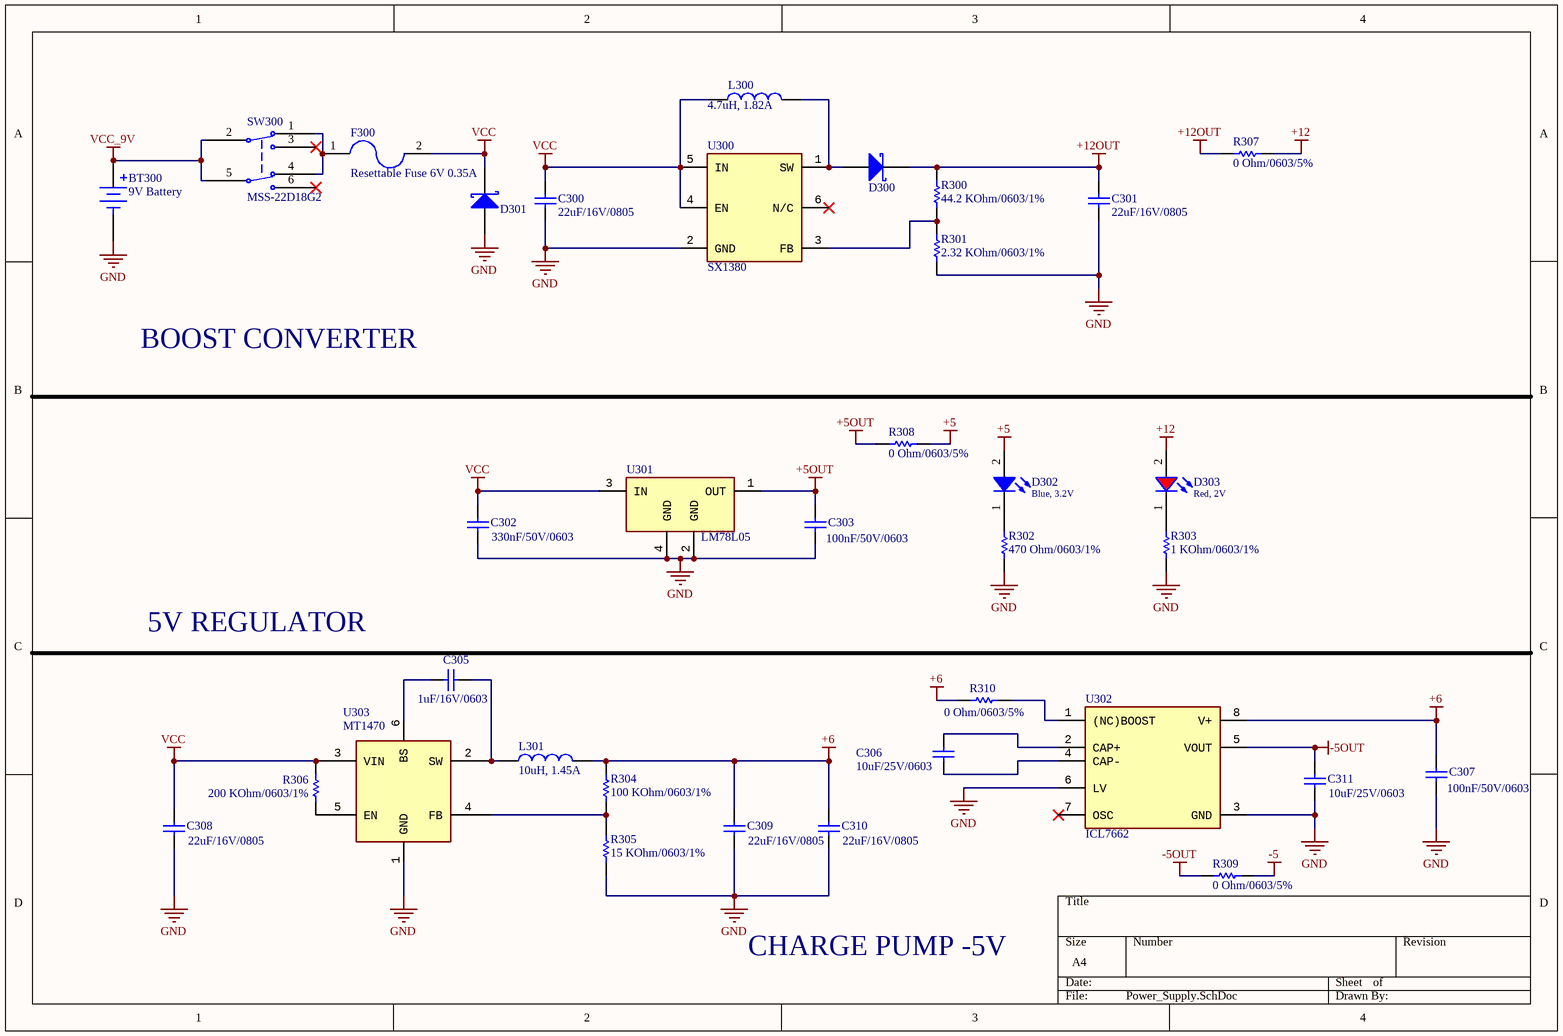
[diagram p3: Power_Supply.SchDoc]

### Parts
BT300  value 9V Battery  [BAT_BC9VPC]  (hidden comment: BC9VPC)
C300  value 22uF/16V/0805  [CAP-SM-0805]  (hidden comment: Cap Non-Pol SMD)
C301  value 22uF/16V/0805  [CAP-SM-0805]  (hidden comment: Cap Non-Pol SMD)
C302  value 330nF/50V/0603  [WCAP-CSGP_0603_H=0.8mm_Reflow]  (hidden comment: 330nF, 50V)
C303  value 100nF/50V/0603  [WCAP-CSGP_0603_H=0.8mm_Reflow]  (hidden comment: 100nF, 25V)
C305  value 1uF/16V/0603  [WCAP-CSGP_0603_H=0.8mm_Reflow]  (hidden comment: 1uF, 16V)
C306  value 10uF/25V/0603  [WCAP-CSGP_0603_H=0.8mm_Reflow]  (hidden comment: 10uF, 6.3V)
C307  value 100nF/50V/0603  [WCAP-CSGP_0603_H=0.8mm_Reflow]  (hidden comment: 100nF, 25V)
C308  value 22uF/16V/0805  [WCAP-CSGP_0805_H=1.25mm]  (hidden comment: 22uF, 10V)
C309  value 22uF/16V/0805  [WCAP-CSGP_0805_H=1.25mm]  (hidden comment: 22uF, 10V)
C310  value 22uF/16V/0805  [WCAP-CSGP_0805_H=1.25mm]  (hidden comment: 22uF, 10V)
C311  value 10uF/25V/0603  [WCAP-CSGP_0603_H=0.8mm_Reflow]  (hidden comment: 10uF, 6.3V)
D300  D Schottky  [SS34]  (value not drawn)
D301  D Schottky  [SS34]  (value not drawn)
D302  Blue, 3.2V  [WL-SMCW_0603_H=0.7mm]
D303  Red, 2V  [WL-SMCW_0603_H=0.7mm]
F300  value Resettable Fuse 6V 0.35A  [FUSE1206]  (hidden comment: RESETTABLE FUSE 1206)
L300  4.7uH, 1.82A  [WE-PD2A_4532]
L301  10uH, 1.45A  [WE-PD2A_4532]
R300  value 44.2 KOhm/0603/1%  [R0603]  (hidden comment: Resistor 44.2 KOhm 0603 1%)
R301  value 2.32 KOhm/0603/1%  [R0603]  (hidden comment: Resistor 2.32 KOhm 0603 1%)
R302  value 470 Ohm/0603/1%  [R0603]  (hidden comment: Resistor 470 Ohm 0603 1%)
R303  value 1 KOhm/0603/1%  [R0603]  (hidden comment: Resistor 1 KOhm 0603 1%)
R304  value 100 KOhm/0603/1%  [R0603]  (hidden comment: Resistor 100 KOhm 0603 1%)
R305  value 15 KOhm/0603/1%  [R0603]  (hidden comment: Resistor 15 KOhm 0603 1%)
R306  value 200 KOhm/0603/1%  [R0603]  (hidden comment: Resistor 200 KOhm 0603 5%)
R307  value 0 Ohm/0603/5%  [R0603]  (hidden comment: Resistor 0 Ohm 0603 5%)
R308  value 0 Ohm/0603/5%  [R0603]  (hidden comment: Resistor 0 Ohm 0603 5%)
R309  value 0 Ohm/0603/5%  [R0603]  (hidden comment: Resistor 0 Ohm 0603 5%)
R310  value 0 Ohm/0603/5%  [R0603]  (hidden comment: Resistor 0 Ohm 0603 5%)
SW300  value MSS-22D18G2  [MSS-22D18G2]  (hidden comment: Slide Switch)
U300  value SX1380  [SOT-23-6]  (hidden comment: SX1308)
U301  value LM78L05  [SOT-89]  (hidden comment: 78L05)
U302  value ICL7662  [SOIC-8]  (hidden comment: ICL7662EBA+)
U303  MT1470  [SOT-23-6]

### Nets
+5: D302.2(A) R308.2
+5OUT: C303.1 R308.1 U301.1(OUT)
+6: C307.1 C309.2 C310.2 L301.2 R304.2 R310.1 U302.8(V+)
+12: D303.2(A) R307.2
+12OUT: C301.2 D300.2(K) R300.2 R307.1
-5: R309.2
-5OUT: C311.2 R309.1 U302.5(VOUT)
GND: BT300.N(NEG) C300.1 C301.1 C302.1 C303.2 C307.2 C308.1 C309.1 C310.1 C311.1 D301.1(A) R301.1 R302.1 R303.1 R305.1 U300.2(GND) U301.2(GND) U301.4(GND) U302.3(GND) U302.6(LV) U303.1(GND)
VCC: C300.2 C302.2 C308.2 D301.2(K) F300.2 L300.1 R306.2 U300.4(EN) U300.5(IN) U301.3(IN) U303.3(VIN)
VCC_9V: BT300.P(POS) SW300.2 SW300.5
NetC305_1: C305.1 U303.6(BS)
NetC305_2: C305.2 L301.1 U303.2(SW)
NetC306_1: C306.1 U302.4(CAP-)
NetC306_2: C306.2 U302.2(CAP+)
NetD300_1: D300.1(A) L300.2 U300.1(SW)
NetD302_1: D302.1(K) R302.2
NetD303_1: D303.1(K) R303.2
NetF300_1: F300.1 SW300.1 SW300.4
NetR300_1: R300.1 R301.2 U300.3(FB)
NetR304_1: R304.1 R305.2 U303.4(FB)
NetR306_1: R306.1 U303.5(EN)
NetR310_2: R310.2 U302.1((NC)BOOST)

Not connected (* = marked no-connect by the designer): SW300 3(13)* 6(15)*; U300 6(N/C)*; U302 7(OSC)*

### Notes on the sheet
- BOOST CONVERTER
- 5V REGULATOR
- CHARGE PUMP -5V

### Library data of the parts
BT300 = BC9VPC: Battery Holder 1 Cells 9V Size Plastic Tray; MF: MPD (Memory Protection Devices); SnapEDA_Link: https://www.snapeda.com/parts/BC9VPC/Memory+Protection+Devices/view-part/?ref=snap; Package: None; MP: BC9VPC; Check_prices: https://www.snapeda.com/parts/BC9VPC/Memory+Protection+Devices/view-part/?ref=eda
C300 C301 = Cap Non-Pol SMD: Capacitor
C302 = 885012206121: as C509 on sheet DSP; ComponentLink1Description: Manufacturer; ComponentLink1URL: http://www.we-online.de; ComponentLink2Description: Datasheet; ComponentLink2URL: https://www.we-online.com/catalog/datasheet/885012206121.pdf; Operating Temperature: -55 to +125degC; Packaging: Tape and Reel; Manufacturer Part Number: 885012206121; Published Date: May 2020; Ceramic Type: X7R; Dissipation Factor: =<10%; Height: 0.8mm; Mounting Technology: SMT; Size: 0603
C303 C307 = 885012206071: as C405 on sheet Measure; ComponentLink1Description: Manufacturer; ComponentLink1URL: http://www.we-online.de; ComponentLink2Description: Datasheet; ComponentLink2URL: https://www.we-online.com/catalog/datasheet/885012206071.pdf; Operating Temperature: -55 to +125degC; Packaging: Tape and Reel; Manufacturer Part Number: 885012206071; Published Date: May 2020; Ceramic Type: X7R; Dissipation Factor: =<3.5%; Height: 0.8mm; Mounting Technology: SMT; Size: 0603
C305 = 885012106017: as C403 on sheet Measure; ComponentLink1Description: Manufacturer; ComponentLink1URL: http://www.we-online.de; ComponentLink2Description: Datasheet; ComponentLink2URL: https://www.we-online.com/catalog/datasheet/885012106017.pdf; Operating Temperature: -55 to +85degC; Packaging: Tape and Reel; Manufacturer Part Number: 885012106017; Published Date: May 2020; Ceramic Type: X5R; Dissipation Factor: =<10%; Height: 0.8mm; Mounting Technology: SMT; Size: 0603
C306 C311 = 885012106006: as C500 on sheet DSP; ComponentLink1Description: Manufacturer; ComponentLink1URL: http://www.we-online.de; ComponentLink2Description: Datasheet; ComponentLink2URL: https://www.we-online.com/catalog/datasheet/885012106006.pdf; Operating Temperature: -55 to +85degC; Packaging: Tape and Reel; Manufacturer Part Number: 885012106006; Published Date: May 2020; Ceramic Type: X5R; Dissipation Factor: =<10%; Height: 0.8mm; Mounting Technology: SMT; Size: 0603
C308-C310 = 885012107011: WCAP-CSGP Multilayer Ceramic Chip Capacitor, General Purpose, size 0805, X5R, 22uF, 10V; Manufacturer: Wurth Elektronik; Rated Voltage: 10VDC; Isolation Resistance: >=0.005GOhm; Capacitance Tolerance: +/-20%; Technical Reference: X5R0805226M010DFCT10000; ComponentLink1Description: Manufacturer; ComponentLink1URL: http://www.we-online.de; ComponentLink2Description: Datasheet; ComponentLink2URL: https://www.we-online.com/catalog/datasheet/885012107011.pdf; Operating Temperature: -55 to +85degC; Packaging: Tape and Reel; Manufacturer Part Number: 885012107011; Published Date: May 2020; Ceramic Type: X5R; Dissipation Factor: =<10%; Height: 1.25mm; Mounting Technology: SMT; Size: 0805
D300 D301 = D Schottky: Schottky Diode; Published: 8-Jun-2000; LatestRevisionDate: 17-Jul-2002; LatestRevisionNote: Re-released for DXP Platform.; PackageReference: SMB; Publisher: Altium Limited; PackageDescription: DO-214-AA/SMB; 2 C-Bend Leads; Body 5.3 x 3.6 mm, inc. leads (LxW); Code_JEDEC: DO-214-AA
D302 = 150060BS75000: WL-SMCW SMT Mono-color Chip LED Waterclear, size 0603, Blue, 3.2V, 140deg; Chip Technology: InGaN; Dominant Wavelength typ.: 470nm; Luminous Intensity typ.: 145mcd; Peak Wavelength typ.: 465nm; Viewing Angle: 140deg; ComponentLink1Description: Manufacturer; ComponentLink1URL: http://www.we-online.de; ComponentLink2URL: https://www.we-online.com/catalog/datasheet/150060BS75000.pdf; ComponentLink2Description: Datasheet; Forward Voltage typ.: 3.2V; Emitting Color: Blue; Mounting Technology: SMT; Operating Temperature: -40 to +85degC; Published Date: December 2019; Part Number: 150060BS75000; Packaging: Tape and Reel; Size: 0603; Publisher: Wurth Elektronik
D303 = 150060RS75000: WL-SMCW SMT Mono-color Chip LED Waterclear, size 0603, Red, 2V, 140deg; Chip Technology: AlInGaP; Dominant Wavelength typ.: 625nm; Luminous Intensity typ.: 250mcd; Peak Wavelength typ.: 630nm; Viewing Angle: 140deg; ComponentLink1Description: Manufacturer; ComponentLink1URL: http://www.we-online.de; ComponentLink2URL: https://www.we-online.com/catalog/datasheet/150060RS75000.pdf; ComponentLink2Description: Datasheet; Forward Voltage typ.: 2V; Emitting Color: Red; Mounting Technology: SMT; Operating Temperature: -40 to +85degC; Published Date: December 2019; Part Number: 150060RS75000; Packaging: Tape and Reel; Size: 0603; Publisher: Wurth Elektronik
F300 = RESETTABLE FUSE 1206: Polymeric PTC Resettable Fuse 6V 350mA Ih Surface Mount 1206 _3216 Metric_, Concave; MF: Littelfuse Inc.; MP: 1206L035YR; Package: 1206 Littelfuse; Price: None; Availability: Unavailable; SnapEDA_Link: https://www.snapeda.com/parts/1206L035YR/Littelfuse%20Inc./view-part/225191/?ref=snap
L300 = 784773047: WE-PD2A SMT Power Inductor, size 4532, 4.7uH, 1.82A; Manufacturer: Wurth Elektronik; DC Resistance max.: 0.11Ohm; Saturation Current: 2.46A; Self Resonant Frequency: 45MHz; DC Resistance typ.: 0.059Ohm; Rated Voltage: 80VDC; ComponentLink1Description: Manufacturer; ComponentLink1URL: http://www.we-online.de; ComponentLink2Description: Datasheet; ComponentLink2URL: https://www.we-online.com/catalog/datasheet/784773047.pdf; Manufacturer Part Number: 784773047; Published Date: May 2020; Rated Current: 1.82A; Value: 4.7uH, 1.82A; Operating Temperature: -40 to +125degC; Mounting Technology: SMT; Packaging: Tape and Reel; Size: 4532
L301 = 78477310: WE-PD2A SMT Power Inductor, size 4532, 10uH, 1.45A; Manufacturer: Wurth Elektronik; DC Resistance max.: 0.182Ohm; Saturation Current: 1.74A; Self Resonant Frequency: 30MHz; DC Resistance typ.: 0.118Ohm; Rated Voltage: 80VDC; ComponentLink1Description: Manufacturer; ComponentLink1URL: http://www.we-online.de; ComponentLink2Description: Datasheet; ComponentLink2URL: https://www.we-online.com/catalog/datasheet/78477310.pdf; Manufacturer Part Number: 78477310; Published Date: May 2020; Rated Current: 1.45A; Inductance: 10uH; Operating Temperature: -40 to +125degC; Mounting Technology: SMT; Packaging: Tape and Reel; Size: 4532
R300 = Resistor 44.2 KOhm 0603 1%: Code (4422, 63C), 1/10W 1%; ComponentLink1Description: Buy; ComponentLink1URL: https://www.thegioiic.com/dien-tro-44-2-kohm-0603-1-
R301 = Resistor 2.32 KOhm 0603 1%: Code (2321, 36B), 1/10W; ComponentLink1Description: Buy; ComponentLink1URL: https://www.thegioiic.com/dien-tro-2-7-kohm-0603-5-
R302 = Resistor 470 Ohm 0603 1%: Code 471, 1/10W; ComponentLink1Description: Buy; ComponentLink1URL: https://www.thegioiic.com/dien-tro-470-ohm-0603-1-
R303 = Resistor 1 KOhm 0603 1%: Code 102, 1/10W; ComponentLink1Description: Buy; ComponentLink1URL: https://www.thegioiic.com/dien-tro-1-kohm-0603-1
R304 = Resistor 100 KOhm 0603 1%: Code 104, 1/10W; ComponentLink1Description: Buy; ComponentLink1URL: https://www.thegioiic.com/dien-tro-100-kohm-0603-1-
R305 = Resistor 15 KOhm 0603 1%: Code 153, 1/10W; ComponentLink1Description: Buy; ComponentLink1URL: https://www.thegioiic.com/dien-tro-15-kohm-0603-1-
R306 = Resistor 200 KOhm 0603 5%: Code 2003, 1/10W; ComponentLink1Description: Buy; ComponentLink1URL: https://www.thegioiic.com/dien-tro-200-kohm-0603-1-
R307-R310 = Resistor 0 Ohm 0603 5%: Code 0R, 1/10W; ComponentLink1Description: Buy; ComponentLink1URL: https://www.thegioiic.com/dien-tro-0-ohm-0603-5-
U300 = SX1308: High Efficiency 1.2MHz 2A Step Up Converter; MF: Semtech Corporation; Price: None; Purchase-URL: https://pricing.snapeda.com/search/part/SX1308/?ref=eda; Check_prices: https://www.snapeda.com/parts/SX1308/Semtech+Corporation/view-part/?ref=eda; SnapEDA_Link: https://www.snapeda.com/parts/SX1308/Semtech+Corporation/view-part/?ref=snap; Availability: In Stock; MP: SX1308; Package: - Semtech Corporation
U301 = 78L05: IC REG LINEAR 5V 100MA SOT89-3; MF: Hottech Co; Availability: Not in stock; Check_prices: https://www.snapeda.com/parts/78L05/Hottech+Semiconductor/view-part/?ref=eda; Package: None; Price: None; MP: 78L05; SnapEDA_Link: https://www.snapeda.com/parts/78L05/Hottech+Semiconductor/view-part/?ref=snap
U302 = ICL7662EBA+: CMOS, Voltage Converters; MF: Analog Devices; Purchase-URL: https://pricing.snapeda.com/search/part/ICL7662EBA+/?ref=eda; MP: ICL7662EBA+; Availability: In Stock; Check_prices: https://www.snapeda.com/parts/ICL7662EBA+/Analog+Devices/view-part/?ref=eda; SnapEDA_Link: https://www.snapeda.com/parts/ICL7662EBA+/Analog+Devices/view-part/?ref=snap; Price: None; Package: SOIC-8 Maxim; ComponentLink1Description: Buy; ComponentLink1URL: https://www.thegioiic.com/icl7662cba
U303 = MT1470: 2A, 4.5 - 18V Input, 500kHz Synchronous Step-Down Converter; ComponentLink1Description: Buy; ComponentLink1URL: https://www.thegioiic.com/mt1470-ic-dieu-chinh-giam-ap-2a-sot-23-6; Value: MT1470
SW300 = Slide Switch: ComponentLink1Description: Buy; ComponentLink1URL: https://www.thegioiic.com/mss-22d18g2-cong-tac-truot-6-chan-smd-2p2t

## Sheet Power_Diagram.SchDoc
size A4; SheetNumber: 1; SheetTotal: 5
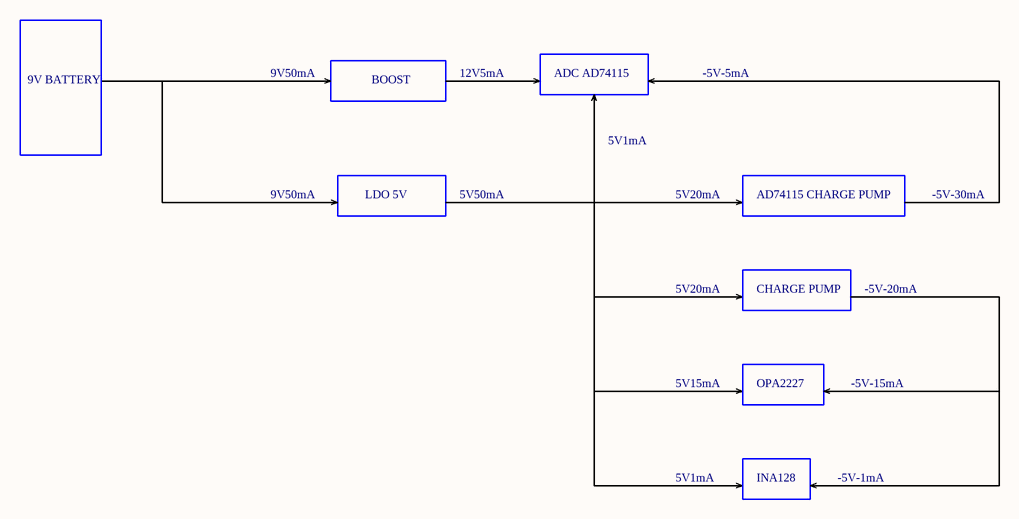
[diagram p4: Power_Diagram.SchDoc]

### Notes on the sheet
- 9V BATTERY
- 9V50mA
- BOOST
- 12V5mA
- ADC AD74115
- -5V-5mA
- 5V1mA
- LDO 5V
- 5V50mA
- 5V20mA
- AD74115 CHARGE PUMP
- -5V-30mA
- CHARGE PUMP
- -5V-20mA
- 5V15mA
- OPA2227
- -5V-15mA
- INA128
- -5V-1mA

## Nets that join several sheets
+5: Measure (6 pins), DSP (13 pins), Power_Supply (D302.2 R308.2)
+12: DSP (C505.2 C506.2 U500.25), Power_Supply (D303.2 R307.2)
-5: Measure (6 pins), Power_Supply (R309.2)
GND: Measure (11 pins), DSP (24 pins), Power_Supply (21 pins)
TO_ADC: Measure (R408.2 TP401.TP1 U401.7), DSP (D500.1 R500.2)